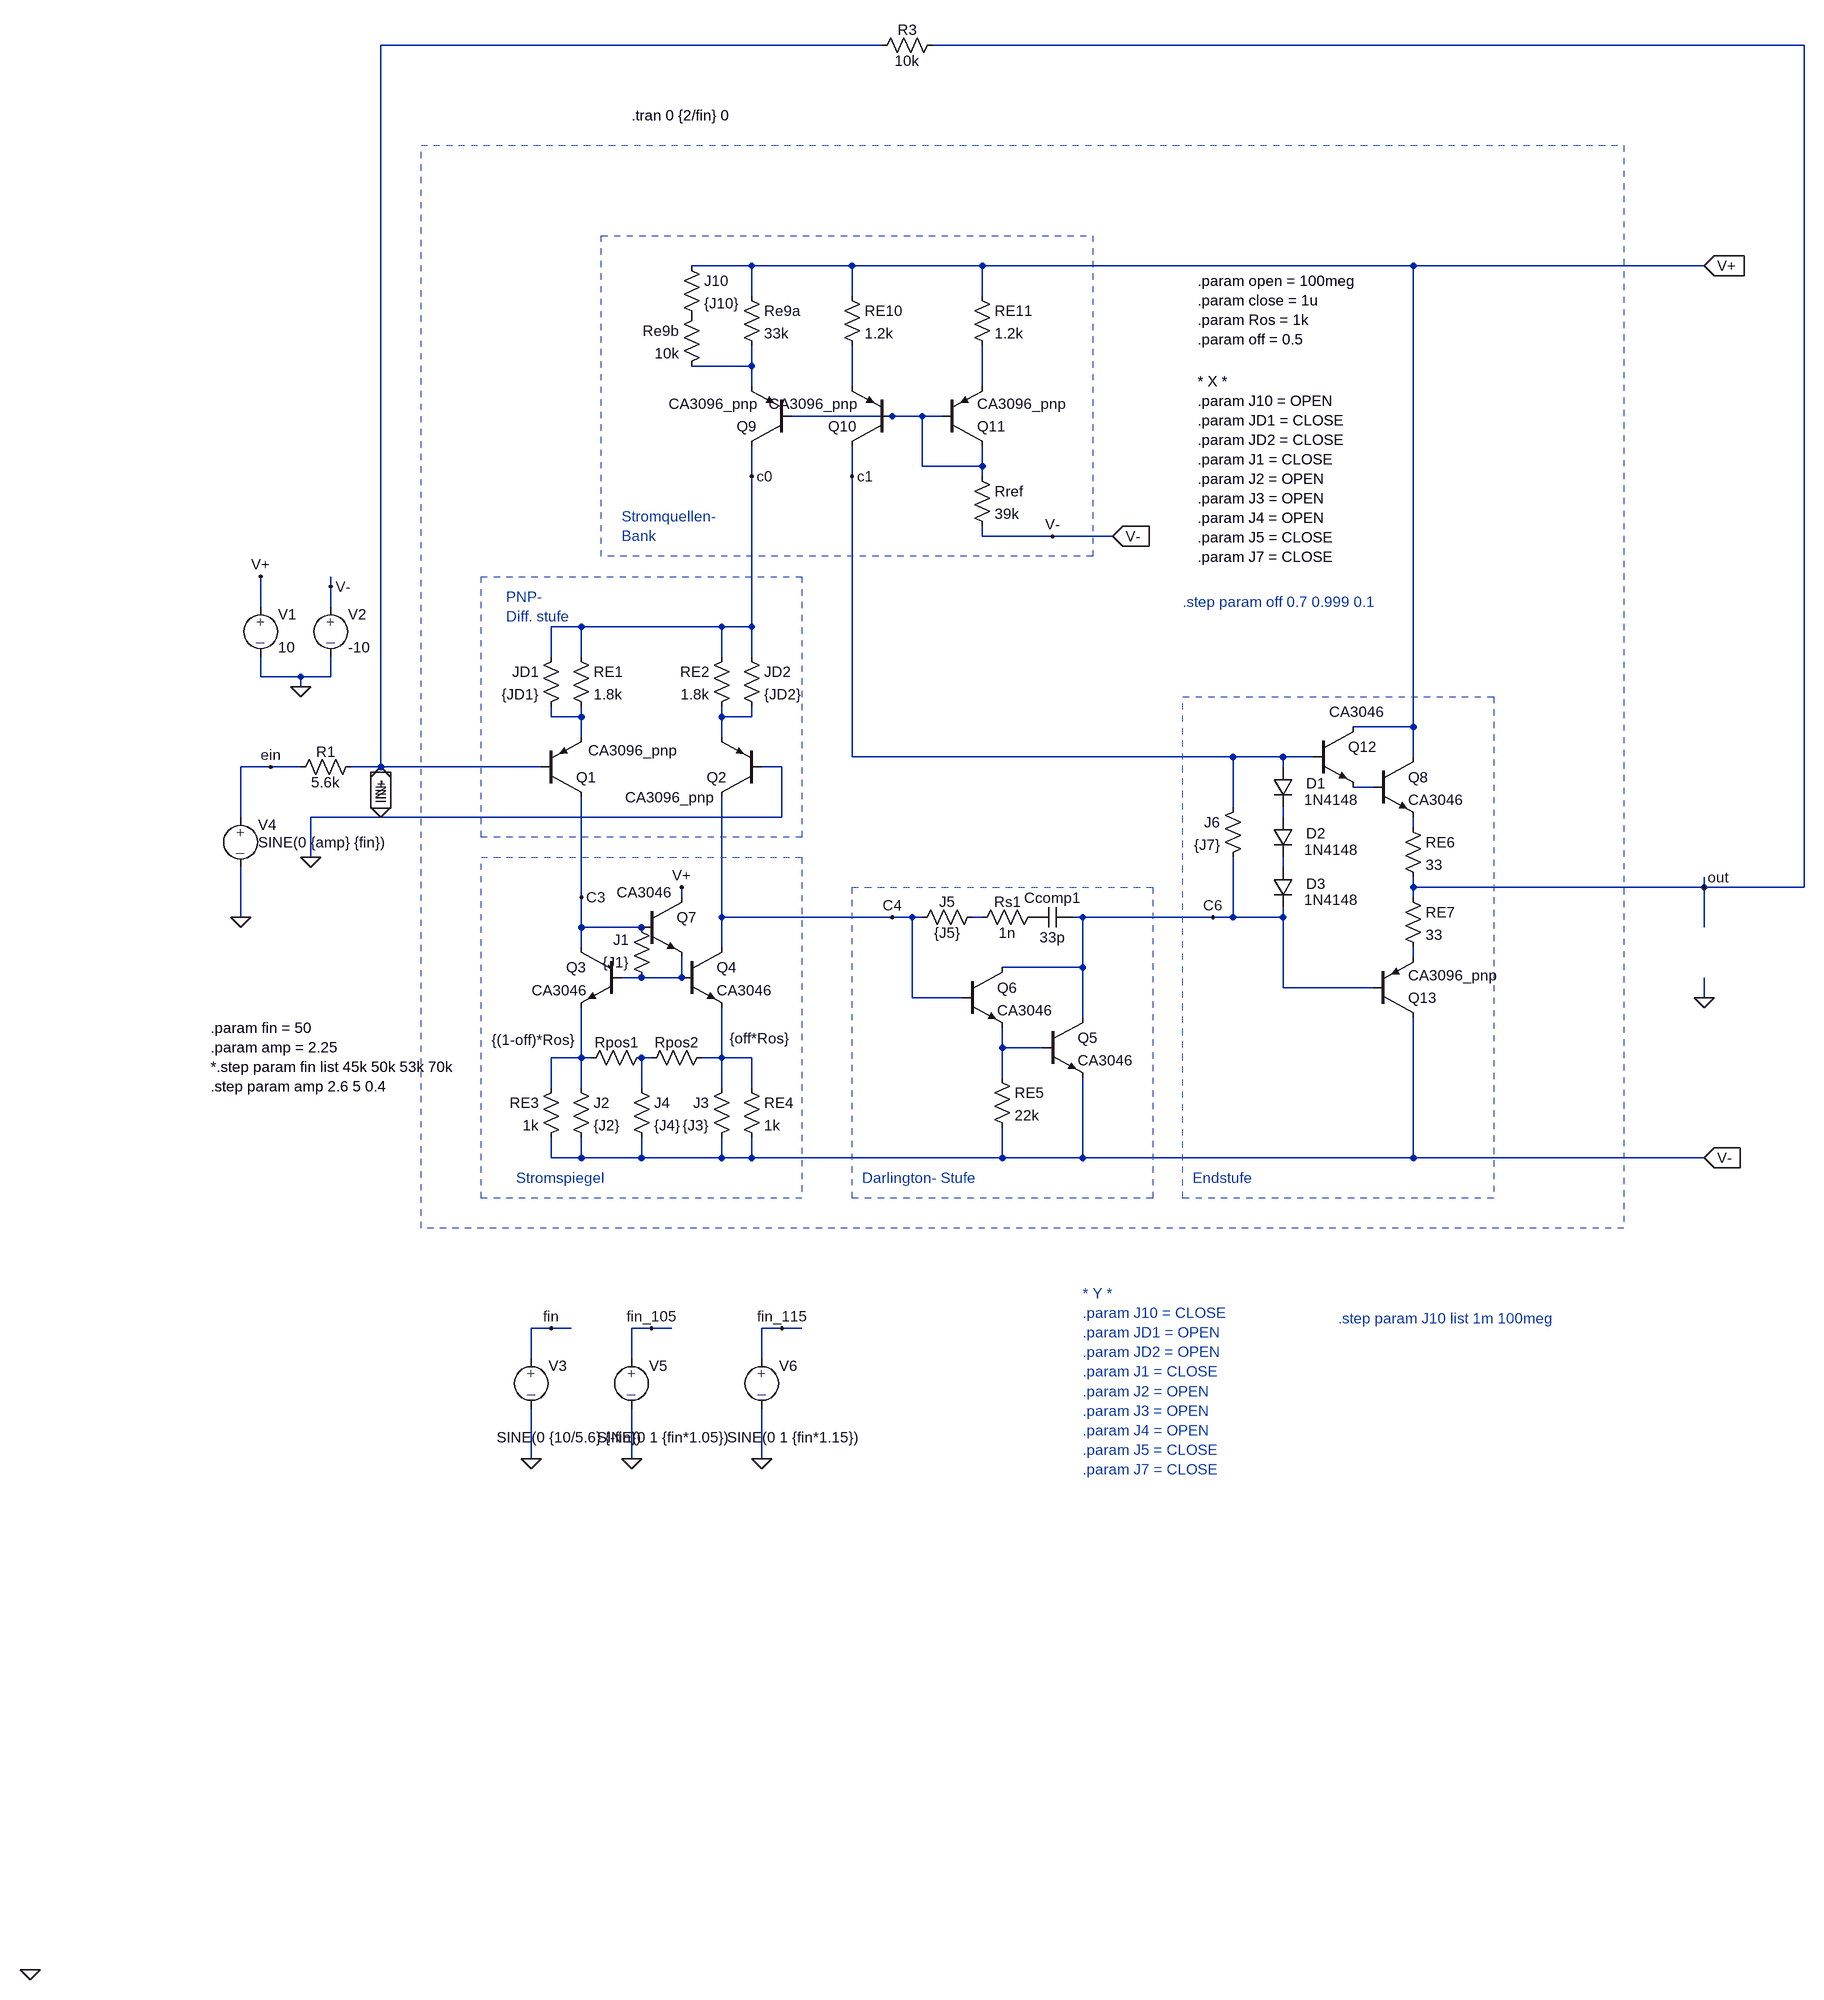
[diagram p0: schematic ausgangsbegr.asc]
ausgangsbegr.asc, the LTspice schematic file:
Version 4
SHEET 1 1188 2276
WIRE -560 -816 -1360 -816
WIRE 912 -816 -480 -816
WIRE -768 -464 -864 -464
WIRE -608 -464 -768 -464
WIRE -400 -464 -608 -464
WIRE 288 -464 -400 -464
WIRE 752 -464 288 -464
WIRE -768 -416 -768 -464
WIRE -608 -416 -608 -464
WIRE -400 -416 -400 -464
WIRE -768 -304 -768 -336
WIRE -768 -304 -864 -304
WIRE -768 -272 -768 -304
WIRE -608 -272 -608 -336
WIRE -400 -272 -400 -336
WIRE -544 -224 -704 -224
WIRE -496 -224 -544 -224
WIRE -464 -224 -496 -224
WIRE -496 -144 -496 -224
WIRE -400 -144 -400 -176
WIRE -400 -144 -496 -144
WIRE -768 -128 -768 -176
WIRE -608 -128 -608 -176
WIRE -400 -128 -400 -144
WIRE -400 -32 -400 -48
WIRE -288 -32 -400 -32
WIRE -192 -32 -288 -32
WIRE -1440 48 -1440 32
WIRE -1552 80 -1552 32
WIRE -1440 80 -1440 48
WIRE -1040 112 -1088 112
WIRE -816 112 -1040 112
WIRE -768 112 -768 -128
WIRE -768 112 -816 112
WIRE -1088 160 -1088 112
WIRE -1040 160 -1040 112
WIRE -816 160 -816 112
WIRE -768 160 -768 112
WIRE -1552 192 -1552 160
WIRE -1488 192 -1552 192
WIRE -1440 192 -1440 160
WIRE -1440 192 -1488 192
WIRE -1488 208 -1488 192
WIRE -1088 256 -1088 240
WIRE -1040 256 -1040 240
WIRE -1040 256 -1088 256
WIRE -816 256 -816 240
WIRE -768 256 -768 240
WIRE -768 256 -816 256
WIRE 288 272 288 -464
WIRE 288 272 192 272
WIRE -1040 288 -1040 256
WIRE -816 288 -816 256
WIRE -608 320 -608 -128
WIRE 0 320 -608 320
WIRE 80 320 0 320
WIRE 128 320 80 320
WIRE 288 320 288 272
WIRE -1536 336 -1584 336
WIRE -1488 336 -1536 336
WIRE -1360 336 -1360 -816
WIRE -1360 336 -1408 336
WIRE -1104 336 -1360 336
WIRE -720 336 -752 336
WIRE 80 336 80 320
WIRE 224 368 192 368
WIRE 0 400 0 320
WIRE -1584 416 -1584 336
WIRE -1360 416 -1472 416
WIRE -720 416 -720 336
WIRE -720 416 -1360 416
WIRE 80 416 80 400
WIRE 288 432 288 416
WIRE -1472 480 -1472 416
WIRE 80 496 80 480
WIRE 288 528 288 512
WIRE 752 528 752 512
WIRE 752 528 288 528
WIRE 912 528 912 -816
WIRE 912 528 752 528
WIRE -1040 544 -1040 384
WIRE -880 544 -880 528
WIRE 288 544 288 528
WIRE -1584 576 -1584 496
WIRE -816 576 -816 384
WIRE -544 576 -816 576
WIRE -512 576 -544 576
WIRE -496 576 -512 576
WIRE -400 576 -416 576
WIRE -240 576 -256 576
WIRE -32 576 -240 576
WIRE 0 576 0 480
WIRE 0 576 -32 576
WIRE 80 576 80 560
WIRE 80 576 0 576
WIRE -1040 592 -1040 544
WIRE -944 592 -1040 592
WIRE 752 592 752 528
WIRE -1040 624 -1040 592
WIRE -816 624 -816 576
WIRE 288 640 288 624
WIRE -240 656 -240 576
WIRE -240 656 -368 656
WIRE -944 672 -976 672
WIRE -880 672 -880 640
WIRE -880 672 -944 672
WIRE 80 688 80 576
WIRE 224 688 80 688
WIRE -512 704 -512 576
WIRE -432 704 -512 704
WIRE 752 704 752 672
WIRE -240 736 -240 656
WIRE -368 784 -368 752
WIRE -304 784 -368 784
WIRE -1040 800 -1040 720
WIRE -1040 800 -1088 800
WIRE -1024 800 -1040 800
WIRE -928 800 -944 800
WIRE -816 800 -816 720
WIRE -816 800 -848 800
WIRE -768 800 -816 800
WIRE -368 832 -368 784
WIRE -1088 848 -1088 800
WIRE -1040 848 -1040 800
WIRE -944 848 -944 800
WIRE -816 848 -816 800
WIRE -768 848 -768 800
WIRE -1088 960 -1088 928
WIRE -1040 960 -1040 928
WIRE -1040 960 -1088 960
WIRE -944 960 -944 928
WIRE -944 960 -1040 960
WIRE -816 960 -816 928
WIRE -816 960 -944 960
WIRE -768 960 -768 928
WIRE -768 960 -816 960
WIRE -368 960 -368 912
WIRE -368 960 -768 960
WIRE -240 960 -240 832
WIRE -240 960 -368 960
WIRE 288 960 288 736
WIRE 288 960 -240 960
WIRE 752 960 288 960
WIRE -1088 1232 -1120 1232
WIRE -1056 1232 -1088 1232
WIRE -928 1232 -960 1232
WIRE -896 1232 -928 1232
WIRE -720 1232 -752 1232
WIRE -688 1232 -720 1232
WIRE -1120 1280 -1120 1232
WIRE -960 1280 -960 1232
WIRE -752 1280 -752 1232
WIRE -1120 1440 -1120 1360
WIRE -960 1440 -960 1360
WIRE -752 1440 -752 1360
FLAG 752 -464 V+
IOPIN 752 -464 In
FLAG -288 -32 V-
FLAG -768 -128 c0
FLAG -608 -128 c1
FLAG -1360 416 IN+
IOPIN -1360 416 In
FLAG -1360 336 IN-
IOPIN -1360 336 In
FLAG 752 960 V-
IOPIN 752 960 In
FLAG -1488 208 0
FLAG -1552 32 V+
FLAG -1440 48 V-
FLAG -880 528 V+
FLAG -1920 2256 0
FLAG -544 576 C4
FLAG -1472 480 0
FLAG -1584 576 0
FLAG -1536 336 ein
FLAG -1040 544 C3
FLAG -192 -32 V-
IOPIN -192 -32 In
FLAG -32 576 C6
FLAG 752 528 out
FLAG 752 704 0
FLAG -1120 1440 0
FLAG -1088 1232 fin
FLAG -960 1440 0
FLAG -928 1232 fin_105
FLAG -752 1440 0
FLAG -720 1232 fin_115
SYMBOL EIT_Semiconductors\\pnp -704 -176 R180
SYMATTR InstName Q9
SYMATTR Value CA3096_pnp
SYMBOL EIT_Semiconductors\\pnp -544 -176 R180
SYMATTR InstName Q10
SYMATTR Value CA3096_pnp
SYMBOL EIT_Semiconductors\\pnp -464 -176 M180
SYMATTR InstName Q11
SYMATTR Value CA3096_pnp
SYMBOL res -416 -432 R0
SYMATTR InstName RE11
SYMATTR Value 1.2k
SYMBOL res -624 -432 R0
SYMATTR InstName RE10
SYMATTR Value 1.2k
SYMBOL res -784 -432 R0
SYMATTR InstName Re9a
SYMATTR Value 33k
SYMBOL res -848 -400 M0
SYMATTR InstName Re9b
SYMATTR Value 10k
SYMBOL res -416 -144 R0
SYMATTR InstName Rref
SYMATTR Value 39k
SYMBOL EIT_Semiconductors\\pnp -752 384 R180
WINDOW 3 77 0 Left 0
SYMATTR Value CA3096_pnp
SYMATTR InstName Q2
SYMBOL EIT_Semiconductors\\pnp -1104 384 M180
WINDOW 3 75 75 Left 0
SYMATTR Value CA3096_pnp
SYMATTR InstName Q1
SYMBOL res -1056 144 R0
SYMATTR InstName RE1
SYMATTR Value 1.8k
SYMBOL res -800 144 M0
SYMATTR InstName RE2
SYMATTR Value 1.8k
SYMBOL res -1072 144 M0
SYMATTR InstName JD1
SYMATTR Value {JD1}
SYMBOL res -784 144 R0
SYMATTR InstName JD2
SYMATTR Value {JD2}
SYMBOL EIT_Semiconductors\\npn -976 624 M0
SYMATTR InstName Q3
SYMATTR Value CA3046
SYMBOL EIT_Semiconductors\\npn -880 624 R0
SYMATTR InstName Q4
SYMATTR Value CA3046
SYMBOL res -928 784 R90
WINDOW 0 7 56 VBottom 0
WINDOW 3 -28 188 VTop 0
SYMATTR InstName Rpos1
SYMATTR Value {(1-off)*Ros}
SYMBOL res -1056 832 R0
SYMATTR InstName J2
SYMATTR Value {J2}
SYMBOL res -800 832 M0
SYMATTR InstName J3
SYMATTR Value {J3}
SYMBOL res -1072 832 M0
SYMATTR InstName RE3
SYMATTR Value 1k
SYMBOL res -784 832 R0
SYMATTR InstName RE4
SYMATTR Value 1k
SYMBOL res -928 688 R180
WINDOW 0 36 76 Left 0
WINDOW 3 36 40 Left 0
SYMATTR InstName J1
SYMATTR Value {J1}
SYMBOL res -832 784 R90
WINDOW 0 7 56 VBottom 0
WINDOW 3 -31 -76 VTop 0
SYMATTR InstName Rpos2
SYMATTR Value {off*Ros}
SYMBOL res -960 832 R0
SYMATTR InstName J4
SYMATTR Value {J4}
SYMBOL source-V -1552 64 R0
WINDOW 123 0 0 Left 0
WINDOW 39 0 0 Left 0
SYMATTR InstName V1
SYMATTR Value 10
SYMBOL source-V -1440 64 R0
WINDOW 123 0 0 Left 0
WINDOW 39 0 0 Left 0
SYMATTR InstName V2
SYMATTR Value -10
SYMBOL source-V -1584 400 R0
WINDOW 123 28 109 Left 0
WINDOW 39 0 0 Left 0
WINDOW 3 28 56 Left 0
SYMATTR Value SINE(0 {amp} {fin})
SYMATTR InstName V4
SYMBOL res -880 -480 R0
SYMATTR InstName J10
SYMATTR Value {J10}
SYMBOL res -1392 320 R90
WINDOW 0 7 56 VBottom 0
WINDOW 3 25 56 VTop 0
SYMATTR InstName R1
SYMATTR Value 5.6k
SYMBOL res -512 592 R270
WINDOW 0 25 56 VTop 0
WINDOW 3 7 56 VBottom 0
SYMATTR InstName J5
SYMATTR Value {J5}
SYMBOL cap -256 560 R90
WINDOW 0 0 32 VBottom 0
WINDOW 3 32 32 VTop 0
SYMATTR InstName Ccomp1
SYMATTR Value 33p
SYMBOL EIT_Semiconductors\\npn -304 736 R0
SYMATTR InstName Q5
SYMATTR Value CA3046
SYMBOL EIT_Semiconductors\\npn -432 656 R0
SYMATTR InstName Q6
SYMATTR Value CA3046
SYMBOL res -384 816 R0
SYMATTR InstName RE5
SYMATTR Value 22k
SYMBOL res -304 560 R90
WINDOW 0 7 56 VBottom 0
WINDOW 3 25 56 VTop 0
SYMATTR InstName Rs1
SYMATTR Value 1n
SYMBOL EIT_Semiconductors\\npn 224 320 R0
SYMATTR InstName Q8
SYMATTR Value CA3046
SYMBOL EIT_Semiconductors\\npn 128 272 R0
WINDOW 3 26 -24 Left 0
SYMATTR Value CA3046
SYMATTR InstName Q12
SYMBOL EIT_Semiconductors\\pnp 224 736 M180
SYMATTR InstName Q13
SYMATTR Value CA3096_pnp
SYMBOL res 272 416 R0
SYMATTR InstName RE6
SYMATTR Value 33
SYMBOL res 272 528 R0
SYMATTR InstName RE7
SYMATTR Value 33
SYMBOL diode 64 336 R0
WINDOW 0 53 26 Left 0
WINDOW 3 50 52 Left 0
SYMATTR InstName D1
SYMATTR Value 1N4148
SYMBOL res 16 384 M0
SYMATTR InstName J6
SYMATTR Value {J7}
SYMBOL diode 64 416 R0
WINDOW 0 53 26 Left 0
WINDOW 3 50 52 Left 0
SYMATTR InstName D2
SYMATTR Value 1N4148
SYMBOL diode 64 496 R0
WINDOW 0 53 26 Left 0
WINDOW 3 50 52 Left 0
SYMATTR InstName D3
SYMATTR Value 1N4148
SYMBOL res -464 -832 R90
WINDOW 0 7 56 VBottom 0
WINDOW 3 25 56 VTop 0
SYMATTR InstName R3
SYMATTR Value 10k
SYMBOL EIT_Semiconductors\\npn -944 544 R0
WINDOW 3 -40 -8 Left 0
SYMATTR Value CA3046
SYMATTR InstName Q7
SYMBOL source-V -1120 1264 R0
WINDOW 123 28 109 Left 0
WINDOW 39 0 0 Left 0
WINDOW 3 -55 142 Left 0
SYMATTR Value SINE(0 {10/5.6} {-fin})
SYMATTR InstName V3
SYMBOL source-V -960 1264 R0
WINDOW 123 28 109 Left 0
WINDOW 39 0 0 Left 0
WINDOW 3 -55 142 Left 0
SYMATTR Value SINE(0 1 {fin*1.05})
SYMATTR InstName V5
SYMBOL source-V -752 1264 R0
WINDOW 123 28 109 Left 0
WINDOW 39 0 0 Left 0
WINDOW 3 -55 142 Left 0
SYMATTR Value SINE(0 1 {fin*1.15})
SYMATTR InstName V6
TEXT -976 -64 Left 0 ;Stromquellen-\nBank
TEXT -1160 64 Left 0 ;PNP-\nDiff. stufe
TEXT -1144 992 Left 0 ;Stromspiegel
TEXT -56 -280 Left 0 !* X *\n.param J10 = OPEN\n.param JD1 = CLOSE\n.param JD2 = CLOSE\n.param J1 = CLOSE\n.param J2 = OPEN\n.param J3 = OPEN\n.param J4 = OPEN\n.param J5 = CLOSE\n.param J7 = CLOSE
TEXT -960 -704 Left 0 !.tran 0 {2/fin} 0
TEXT -80 72 Left 0 ;.step param off 0.7 0.999 0.1
TEXT -592 992 Left 0 ;Darlington- Stufe
TEXT -64 992 Left 0 ;Endstufe
TEXT -56 -440 Left 0 !.param open = 100meg\n.param close = 1u\n.param Ros = 1k\n.param off = 0.5
TEXT -240 1176 Left 0 ;* Y *\n.param J10 = CLOSE\n.param JD1 = OPEN\n.param JD2 = OPEN\n.param J1 = CLOSE\n.param J2 = OPEN\n.param J3 = OPEN\n.param J4 = OPEN\n.param J5 = CLOSE\n.param J7 = CLOSE
TEXT -1632 752 Left 0 !.param fin = 50\n.param amp = 2.25\n*.step param fin list 45k 50k 53k 70k\n.step param amp 2.6 5 0.4
TEXT 168 1216 Left 0 ;.step param J10 list 1m 100meg
RECTANGLE Normal -224 0 -1008 -512 2
RECTANGLE Normal -688 448 -1200 32 2
RECTANGLE Normal -688 1024 -1200 480 2
RECTANGLE Normal 624 1072 -1296 -656 1
RECTANGLE Normal -128 1024 -608 528 2
RECTANGLE Normal 416 1024 -80 224 2

The netlist it stands for:
* ausgangsbegr.asc
Q9 c0 N004 N001 0 CA3096_pnp
Q10 c1 N004 N002 0 CA3096_pnp
Q11 N004 N004 N003 0 CA3096_pnp
RE11 V+ N003 1.2k
RE10 V+ N002 1.2k
Re9a V+ N001 33k
Re9b P001 N001 10k
Rref N004 V- 39k
Q2 C4 0 N006 0 CA3096_pnp
Q1 C3 IN- N005 0 CA3096_pnp
RE1 c0 N005 1.8k
RE2 c0 N006 1.8k
R§JD1 c0 N005 {JD1}
R§JD2 c0 N006 {JD2}
Q3 C3 N013 N015 0 CA3046
Q4 C4 N013 N017 0 CA3046
Rpos1 N016 N015 {(1-off)*Ros}
R§J2 N015 V- {J2}
R§J3 N017 V- {J3}
RE3 N015 V- 1k
RE4 N017 V- 1k
R§J1 N013 C3 {J1}
Rpos2 N017 N016 {off*Ros}
R§J4 N016 V- {J4}
V1 V+ 0 10
V2 V- 0 -10
V4 ein 0 SINE(0 {amp} {fin})
R§J10 V+ P001 {J10}
R1 IN- ein 5.6k
R§J5 C4 N011 {J5}
Ccomp1 C6 P002 33p
Q5 C6 N014 V- 0 CA3046
Q6 C6 C4 N014 0 CA3046
RE5 N014 V- 22k
Rs1 P002 N011 1n
Q8 V+ N007 N009 0 CA3046
Q12 V+ c1 N007 0 CA3046
Q13 V- C6 N012 0 CA3096_pnp
RE6 N009 out 33
RE7 out N012 33
D1 c1 N008 1N4148
R§J6 c1 C6 {J7}
D2 N008 N010 1N4148
D3 N010 C6 1N4148
R3 out IN- 10k
Q7 V+ C3 N013 0 CA3046
V3 fin 0 SINE(0 {10/5.6} {-fin})
V5 fin_105 0 SINE(0 1 {fin*1.05})
V6 fin_115 0 SINE(0 1 {fin*1.15})
.model D D
.lib standard.dio
.model NPN NPN
.model PNP PNP
.lib standard.bjt
* Stromquellen-
* Bank
* PNP-
* Diff. stufe
* Stromspiegel
* X *
.param J10 = OPEN
.param JD1 = CLOSE
.param JD2 = CLOSE
.param J1 = CLOSE
.param J2 = OPEN
.param J3 = OPEN
.param J4 = OPEN
.param J5 = CLOSE
.param J7 = CLOSE
.tran 0 {2/fin} 0
* .step param off 0.7 0.999 0.1
* Darlington- Stufe
* Endstufe
.param open = 100meg
.param close = 1u
.param Ros = 1k
.param off = 0.5
* * Y *
* .param J10 = CLOSE
* .param JD1 = OPEN
* .param JD2 = OPEN
* .param J1 = CLOSE
* .param J2 = OPEN
* .param J3 = OPEN
* .param J4 = OPEN
* .param J5 = CLOSE
* .param J7 = CLOSE
.param fin = 50
.param amp = 2.25
*.step param fin list 45k 50k 53k 70k
.step param amp 2.6 5 0.4
* .step param J10 list 1m 100meg
.backanno
.end